# EAGLE design NE602-Upconverter (EAGLE 7.7.0)
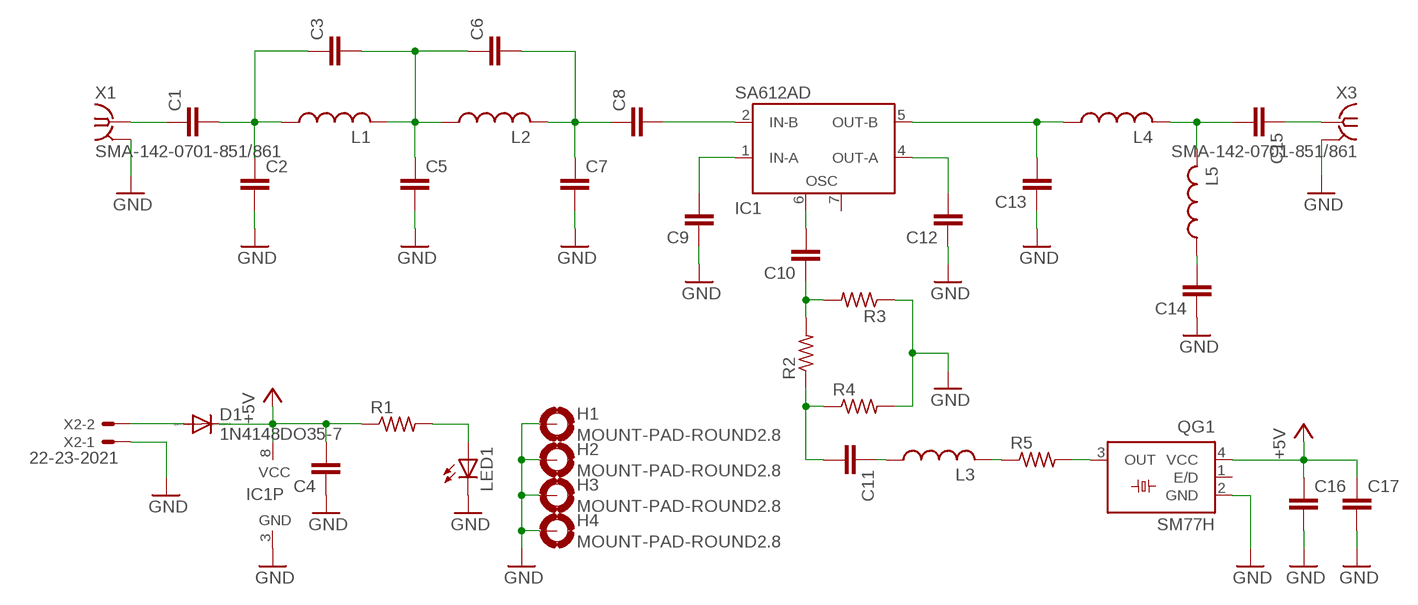
[diagram p0: schematic, sheet 1]

## Parts
C1  C-EUC1206  [C1206]
C2  C-EUC1206  [C1206]
C3  C-EUC1206  [C1206]
C4  C-EUC1206  [C1206]
C5  C-EUC1206  [C1206]
C6  C-EUC1206  [C1206]
C7  C-EUC1206  [C1206]
C8  C-EUC1206  [C1206]
C9  C-EUC1206  [C1206]
C10  C-EUC1206  [C1206]
C11  C-EUC1206  [C1206]
C12  C-EUC1206  [C1206]
C13  C-EUC1206  [C1206]
C14  C-EUC1206  [C1206]
C15  C-EUC1206  [C1206]
C16  C-EUC1206  [C1206]
C17  C-EUC1206  [C1206]
D1  1N4148DO35-7  [DO35-7]
H1  MOUNT-PAD-ROUND2.8  [2,8-PAD]
H2  MOUNT-PAD-ROUND2.8  [2,8-PAD]
H3  MOUNT-PAD-ROUND2.8  [2,8-PAD]
H4  MOUNT-PAD-ROUND2.8  [2,8-PAD]
IC1  SA612AD  [SO08]
L1  L-USL3225M  [L3225M]
L2  L-USL3225M  [L3225M]
L3  L-USL3225M  [L3225M]
L4  L-USL3225M  [L3225M]
L5  L-USL3225M  [L3225M]
LED1  LED3MM  [LED3MM]
QG1  SM77H  [SM77H]
R1  R-US_M1206  [M1206]
R2  R-US_M1206  [M1206]
R3  R-US_M1206  [M1206]
R4  R-US_M1206  [M1206]
R5  R-US_M1206  [M1206]
X1  SMA-142-0701-851/861  [J502-ND-142-0701-851/861]
X2  22-23-2021  [22-23-2021]
X3  SMA-142-0701-851/861  [J502-ND-142-0701-851/861]

## Nets
+5V: C4.2 C16.1 C17.1 D1.C IC1.8(VCC) QG1.4(VCC) R1.1
GND: C2.2 C4.1 C5.2 C7.2 C9.1 C12.1 C13.1 C14.1 C16.2 C17.2 H1.B2,8(MOUNT) H2.B2,8(MOUNT) H3.B2,8(MOUNT) H4.B2,8(MOUNT) IC1.3(GND) LED1.K(C) QG1.2(GND) R3.1 R4.2 X1.G@1 X1.G@2 X1.G@3 X1.G@4 X2.1 X3.G@1 X3.G@2 X3.G@3 X3.G@4
N$1: C1.2 C2.1 C3.1 L1.1
N$2: C3.2 C5.1 C6.1 L1.2 L2.1
N$3: C6.2 C7.1 C8.1 L2.2
N$4: C8.2 IC1.2(IN-B)
N$5: C9.2 IC1.1(IN-A)
N$6: C10.2 IC1.6(OSC)
N$7: C14.2 L5.1
N$8: C13.2 IC1.5(OUT-B) L4.1
N$9: C15.2 L4.2 L5.2
N$10: C12.2 IC1.4(OUT-A)
N$11: C11.2 R2.1 R4.1
N$12: C10.1 R2.2 R3.2
N$13: C11.1 L3.1
N$14: LED1.A R1.2
N$15: L3.2 R5.1
N$16: QG1.3(OUT) R5.2
N$18: C1.1 X1.1
N$19: C15.1 X3.1
N$20: D1.A X2.2
Unconnected: IC1.7(OSC') QG1.1(E/D)

## Library data of the parts
C1-C17 = rcl:C-EU: CAPACITOR, European symbol
D1 = diode:1N4148: DIODE high speed (Philips)
H1-H4 = holes:MOUNT-PAD-ROUND: MOUNTING PAD, round
IC1 = linear:SA612A: Double-balanced mixer and oscillator NE612/SA612 Source: www-eu2.semiconductors.philips.com/acrobat/datasheets/SA612A.pdf
L1-L5 = rcl:L-US: INDUCTOR, American symbol
LED1 = led:LED: LED OSRAM: - CHIPLED LG R971, LG N971, LY N971, LG Q971, LY Q971, LO R971, LY R971 LH N974, LH R974 LS Q976, LO Q976, LY Q976 LO Q996 - Hyper CHIPLED LW Q18S LB Q993, LB Q99A, LB R99A - SideLED LS A670, LO A670, LY A670, LG A670, LP A670 LB A673, LV A673, LT A673, LW A673 LH A674 LY A675 LS A676, LA A676, LO A676, LY A676, LW A676 LS A679, LY A679, LG A679 - Hyper Micro SIDELED® LS Y876, LA Y876, LO Y876, LY Y876 LT Y87S - SmartLED LW L88C, LW L88S LB L89C, LB L89S, LG L890 LS L89K, LO L89K, LY L89K LS L896, LA L896, LO L896, LY L896 - TOPLED LS T670, LO T670, LY T670, LG T670, LP T670 LSG T670, LSP T670, LSY T670, LOP T670, LYG T670 LG T671, LOG T671, LSG T671 LB T673, LV T673, LT T673, LW T673 LH T674 LS T676, LA T676, LO T676, LY T676, LB T676, LH T676, LSB T676, LW T676 LB T67C, LV T67C, LT T67C, LS T67K, LO T67K, LY T67K, LW E67C LS E67B, LA E67B, LO E67B, LY E67B, LB E67C, LV E67C, LT E67C LW T67C LS T679, LY T679, LG T679 LS T770, LO T770, LY T770, LG T770, LP T770 LB T773, LV T773, LT T773, LW T773 LH T774 LS E675, LA E675, LY E675, LS T675 LS T776, LA T776, LO T776, LY T776, LB T776 LHGB T686 LT T68C, LB T68C - Hyper Mini TOPLED® LB M676 - Mini TOPLED Santana® LG M470 LS M47K, LO M47K, LY M47K Source: http://www.osram.convergy.de LUXEON: - LUMILED® LXK2-PW12-R00, LXK2-PW12-S00, LXK2-PW14-U00, LXK2-PW14-V00 LXK2-PM12-R00, LXK2-PM12-S00, LXK2-PM14-U00 LXK2-PE12-Q00, LXK2-PE12-R00, LXK2-PE12-S00, LXK2-PE14-T00, LXK2-PE14-U00 LXK2-PB12-K00, LXK2-PB12-L00, LXK2-PB12-M00, LXK2-PB14-N00, LXK2-PB14-P00, LXK2-PB14-Q00 LXK2-PR12-L00, LXK2-PR12-M00, LXK2-PR14-Q00, LXK2-PR14-R00 LXK2-PD12-Q00, LXK2-PD12-R00, LXK2-PD12-S00 LXK2-PH12-R00, LXK2-PH12-S00 LXK2-PL12-P00, LXK2-PL12-Q00, LXK2-PL12-R00 Source: www.luxeon.com KINGBRIGHT: KA-3528ASYC Source: www.kingbright.com
QG1 = crystal:SM77H: 3.3V CMOS Clock Oscillator Source: www.pletronics.com .. sm77h%203.3v.pdf; OC_FARNELL: unknown; OC_NEWARK: unknown
R1-R5 = rcl:R-US_: RESISTOR, American symbol
X1 X3 = con-coax:SMA-: SMA 50 Ohm End Launch Jack Receptacle - Round Contact Johnson Components Source: www.johnsoncomponents.com .. J502-ND.pdf; MF: JOHNSON COMPONENTS; MPN: 142-0701-851; OC_FARNELL: 1019325; OC_NEWARK: 99F6798
X2 = con-molex:22-23-2021: .100" (2.54mm) Center Header - 2 Pin; MF: MOLEX; MPN: 22-23-2021; OC_FARNELL: 1462926; OC_NEWARK: 25C3832

## Board
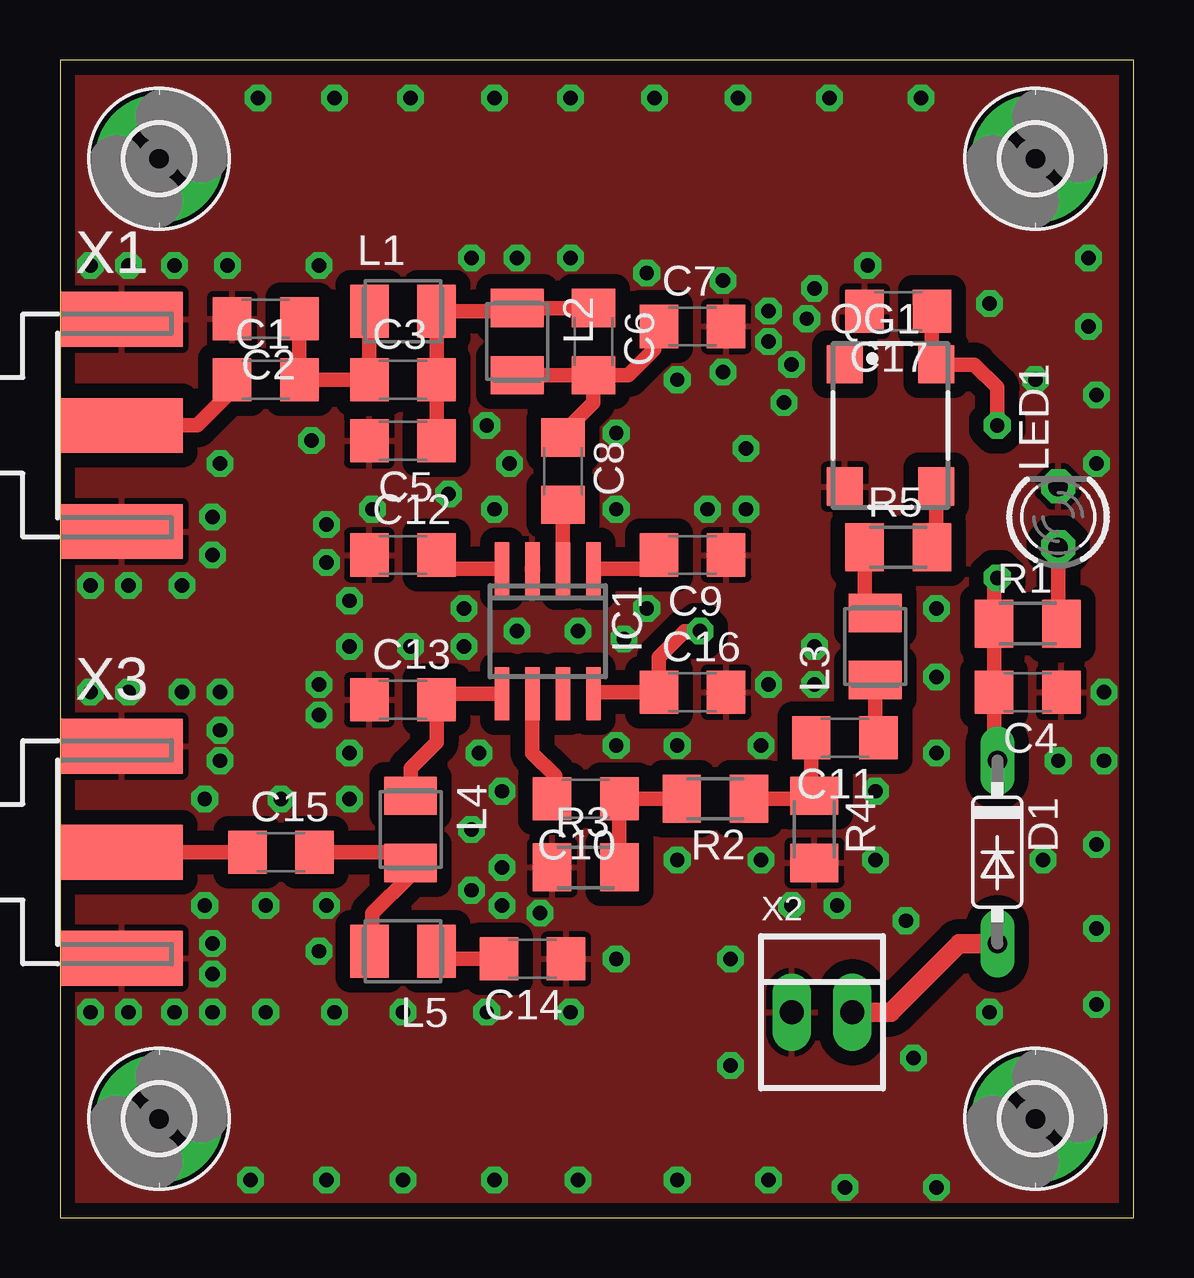
[diagram p1: board, top side]
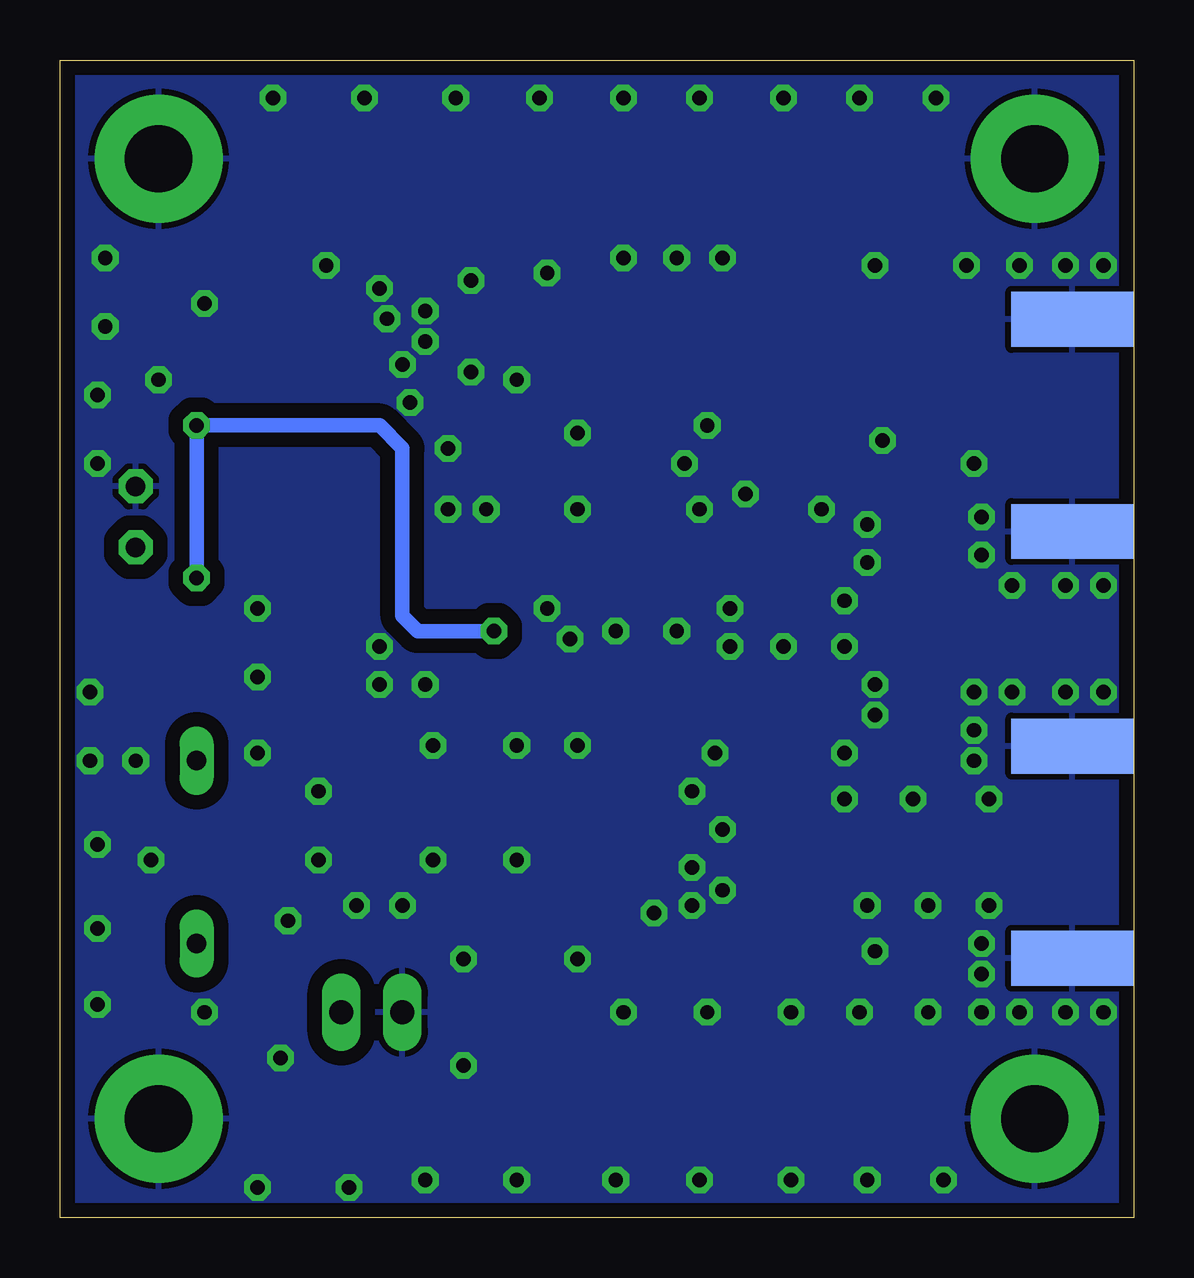
[diagram p2: board, bottom side, seen from below]

Size 44.75 x 48.25 mm. Coordinates in mm from the lower left corner, seen from the top.
Outline: 0,0 44.75,0 44.75,48.25 0,48.25 0,0
Copper layers (1*16): Top 0.035mm / dielectric 1.5mm / Bottom 0.035mm
Design rules "SparkFun": minimum track width 8mil, minimum drill 20mil, track to track 8mil, track to pad 8mil, pad to pad 8mil, via to via 8mil, smd to smd 8mil, copper to edge 10mil, drill to drill 8mil, minimum pad ring 12mil, minimum via ring 10mil, stop-mask expansion 4mil, vias tented up to drill 25mil, thermal gap 10mil

### Footprints (pad centres in the part's own frame; a part is rotated, then mirrored left to right if it is on the bottom)
C1206 = smd 1.6 x 1.8: 1 -1.4,0; 2 1.4,0
DO35-7 = drill 0.813 long: A 3.81,0; C -3.81,0
2,8-PAD = drill 2.8 pad 5.334: B2,8 0,0
SO08 = smd 0.6 x 2.2: 1 -1.905,-2.6; 2 -0.635,-2.6; 3 0.635,-2.6; 4 1.905,-2.6; 5 1.905,2.6; 6 0.635,2.6; 7 -0.635,2.6; 8 -1.905,2.6
L3225M = smd 1.6 x 2.2: 1 -1.4,0; 2 1.4,0
LED3MM = drill 0.813 octagon: A -1.27,0; K 1.27,0
SM77H = smd 1.6 x 1.5: 1 -2.55,-1.9; 2 2.55,-1.9; 3 2.55,1.9; 4 -2.55,1.9
M1206 = smd 1.6 x 2: 1 -1.4,0; 2 1.4,0
J502-ND-142-0701-851/861 = smd 5.08 x 2.286: 1 2.565,0; G@1 2.565,4.42; G@2 2.565,-4.42 | smd 5.08 x 2.286 bottom: G@3 2.565,4.42; G@4 2.565,-4.42
22-23-2021 = drill 1 long: 1 -1.27,0; 2 1.27,0

### Placement (x,y rotation side)
C1  8.57,34.92 0 top
C2  8.57,37.47 180 top
C3  14.29,34.92 0 top
C4  40.32,21.91 180 top
C5  14.29,32.39 180 top
C6  22.23,36.51 270 top
C7  26.35,37.15 0 top
C8  20.95,31.11 270 top
C9  26.35,27.62 180 top
C10  21.91,17.46 180 top
C11  32.7,20 180 top
C12  14.29,27.62 0 top
C13  14.29,21.59 0 top
C14  19.69,10.8 180 top
C15  9.21,15.24 0 top
C16  26.35,21.91 0 top
C17  34.92,37.78 180 top
D1  39.05,15.24 270 top
H1  4.13,44.13 0 top
H2  40.64,4.13 0 top
H3  40.64,44.13 0 top
H4  4.13,4.13 0 top
IC1  20.32,24.45 180 top
L1  14.29,37.78 0 top
L2  19.05,36.51 270 top
L3  33.97,23.81 90 top
L4  14.6,16.19 270 top
L5  14.29,11.11 180 top
LED1  41.59,29.21 90 top
QG1  34.61,33.02 270 top
R1  40.32,24.77 0 top
R2  27.3,17.46 180 top
R3  21.91,14.6 0 top
R4  31.43,16.19 270 top
R5  34.92,27.94 0 top
X1  0,33.02 0 top
X2  31.75,8.57 0 top
X3  0,15.24 0 top

### Tracks (layer width: path | path; a pad name or v marks a point on that pad's centre or on a via)
+5V  (via drill 0.6 pad 1.02)
  Top 0.61: D1.C 38.92,19.18 C4.2 R1.1 38.92,26.54 v39.05,26.67 | C17.1 36.33,35.75 QG1.4 38.1,35.56 39.05,34.61 v39.05,33.02 | IC1.8 22.28,21.91 C16.1 24.95,23.36 26.03,24.45 v26.67,24.45
  Bottom 0.61: v26.67,24.45 29.84,24.45 30.48,25.08 30.48,32.07 31.43,33.02 v39.05,33.02 v39.05,26.67
GND  (via drill 0.6 pad 1.02)
  other vias: 25.72,19.68 16.83,23.81 16.83,25.4 23.18,19.68 24.45,25.4 23.49,24.13 19.05,24.45 21.59,24.45 17.46,19.37 17.14,13.65 17.14,16.19 6.35,8.57 8.57,8.57 11.43,8.57 14.29,8.57 17.78,8.57 21.27,8.57 23.18,10.8 20,12.7 18.41,13.02 6.03,13.02 8.57,13.02 11.11,13.02 6.03,17.46 12.06,19.37 12.06,23.81 14.6,23.81 10.8,22.22 10.8,20.95 25.72,14.92 30.48,13.02 32.39,13.02 29.21,19.68 29.53,22.22 31.43,22.22 33.97,17.78 33.97,14.92 29.21,14.92 26.99,29.53 28.58,29.53 23.18,29.53 12.06,25.72 11.11,27.3 11.11,28.89 13.02,29.53 6.67,31.43 10.48,32.39 16.19,30.16 18.1,29.53 17.78,33.02 18.73,31.43 6.35,29.21 6.35,27.62 1.27,39.69 2.86,39.69 4.76,39.69 6.98,39.69 10.8,39.69 17.14,40 19.05,40 21.27,40 24.45,39.37 27.62,39.05 27.62,35.24 23.18,32.7 25.72,34.92 29.53,36.51 29.53,37.78 33.66,39.69 31.43,38.73 31.12,37.47 30.48,35.56 30.16,33.97 28.58,32.07 31.43,23.81 36.51,25.4 36.51,22.54 36.51,19.37 9.21,17.46 12.06,17.46 1.27,21.91 5.08,21.91 6.67,20.32 6.67,19.05 1.27,8.57 4.76,8.57 6.35,11.43 6.35,10.16 10.8,11.11 18.41,14.6 18.41,17.78 1.27,26.35 5.08,26.35 2.86,26.35 2.86,21.91 2.86,8.57 6.67,21.91 8.26,46.67 11.43,46.67 14.6,46.67 18.1,46.67 21.27,46.67 24.77,46.67 28.26,46.67 32.07,46.67 35.88,46.67 42.86,40 42.86,37.15 43.18,34.29 43.18,31.43 38.73,38.1 40.64,34.92 43.5,21.91 43.5,19.05 41.59,19.05 40.96,14.92 35.24,12.38 43.18,15.56 43.18,12.06 43.18,8.89 36.51,1.27 32.7,1.27 29.53,1.59 25.72,1.59 21.59,1.59 18.1,1.59 14.29,1.59 11.11,1.59 7.94,1.59 27.94,10.8 27.94,6.35 35.56,6.67 38.73,8.57
  pour Top (isolate 0.61): 0,48.26 44.77,48.26 44.77,0 0,0
  pour Bottom (isolate 0.61): 0,48.26 44.77,48.26 44.77,0 0,0
N$1
  Top 0.61: L1.1 C3.1 C1.2 C2.1
N$2
  Top 0.61: C5.1 C3.2 L1.2 18.92,37.78 L2.1 C6.1
N$3
  Top 0.61: L2.2 C6.2 | C8.1 20.95,32.7 22.23,33.97 C6.2 | C6.2 23.68,35.11 24.77,36.19 24.77,36.96 C7.1
N$4
  Top 0.61: IC1.2 C8.2
N$5
  Top 0.61: IC1.1 24.38,27.05 C9.2
N$6
  Top 0.61: IC1.6 19.69,19.37 20.64,18.41 20.64,17.59 C10.2
N$7
  Top 0.61: C14.2 16.01,10.8 L5.1
N$8
  Top 0.61: IC1.5 15.95,21.85 C13.2 15.69,19.81 14.6,18.73 L4.1
N$9
  Top 0.61: L5.2 13.02,11.24 13.02,12.7 14.6,14.29 L4.2 14.16,15.24 C15.2
N$10
  Top 0.61: IC1.4 16.26,27.05 C12.2
N$11
  Top 0.61: R2.1 31.3,17.46 R4.1 31.3,17.72 C11.2
N$12
  Top 0.61: R2.2 C10.1 R3.2
N$13
  Top 0.61: L3.1 33.97,20.13 C11.1
N$14
  Top 0.61: LED1.A 41.59,24.89 R1.2
N$15
  Top 0.61: R5.1 33.53,25.66 L3.2
N$16
  Top 0.61: QG1.3 36.51,28.12 R5.2
N$18
  Top 0.61: C1.1 7.17,34.48 5.71,33.02 X1.1
N$19
  Top 0.61: X3.1 C15.1
N$20
  Top 0.813: X2.2 34.61,8.57 37.47,11.43 D1.A